# Altium schematic sheet Instruction Register.SchDoc
size A; Author: E. Sims; Organization: Let's Build Rockets Inc.; SheetNumber: 3; SheetTotal: 3
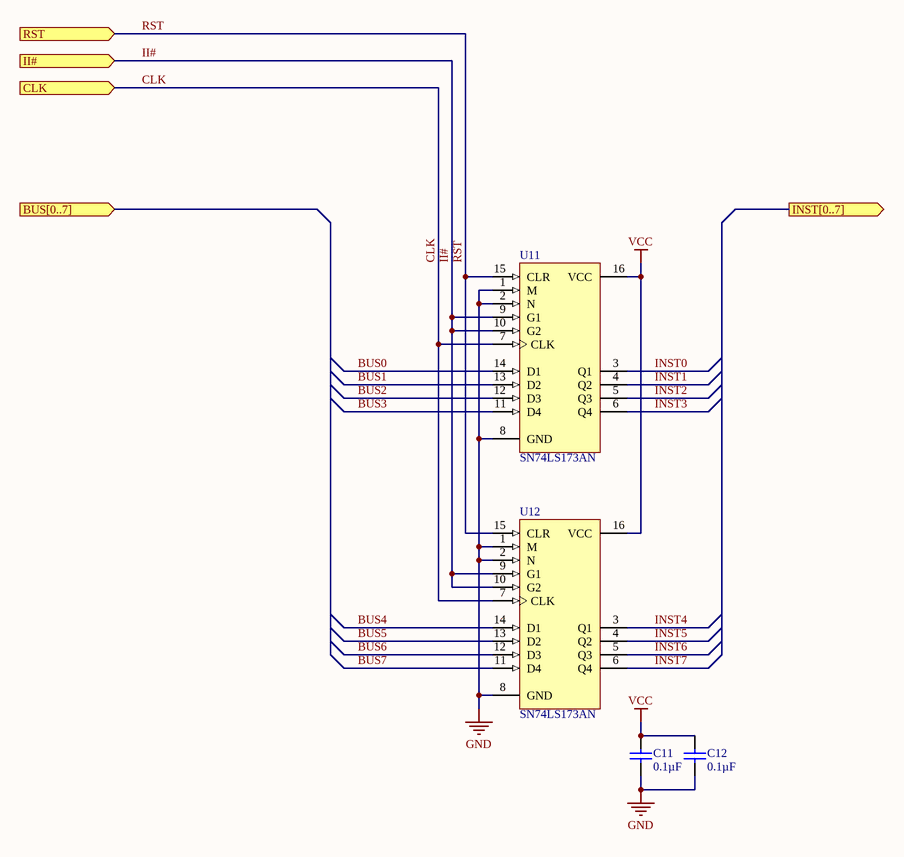
[diagram p0: Instruction Register.SchDoc]

## Parts
C11  Capacitance: 0.1µF  [VISH-K104K15X7RF5TL2]  (hidden comment: K104K15X7RF5TL2)
C12  Capacitance: 0.1µF  [VISH-K104K15X7RF5TL2]  (hidden comment: K104K15X7RF5TL2)
U11  SN74LS173AN  [N016D]
U12  SN74LS173AN  [N016D]

## Ports
BUS[0..7] (in), CLK (in), II# (in), INST[0..7] (out), RST (in)

## Nets
GND: C11.2 C12.2 U11.1(M) U11.2(N) U11.8(GND) U12.1(M) U12.2(N) U12.8(GND)
VCC: C11.1 C12.1 U11.16(VCC) U12.16(VCC)
BUS0: U11.14(D1)
BUS1: U11.13(D2)
BUS2: U11.12(D3)
BUS3: U11.11(D4)
BUS4: U12.14(D1)
BUS5: U12.13(D2)
BUS6: U12.12(D3)
BUS7: U12.11(D4)
CLK: U11.7(CLK) U12.7(CLK) ; port CLK
II#: U11.9(G1) U11.10(G2) U12.9(G1) U12.10(G2) ; port II#
INST0: U11.3(Q1)
INST1: U11.4(Q2)
INST2: U11.5(Q3)
INST3: U11.6(Q4)
INST4: U12.3(Q1)
INST5: U12.4(Q2)
INST6: U12.5(Q3)
INST7: U12.6(Q4)
RST: U11.15(CLR) U12.15(CLR) ; port RST

## Notes on the sheet
- Let's Build Rocket's Inc. Modular Paylaod System Based on TMP-010 Rev
  For more information visit https://github.com/LetsBuildRockets/Modular-Payload-System
  This work is licensed under CC BY-NC 4.0. To view a copy of this license, visit https://creativecommons.org/licenses/by-nc/4.0
- Title
- Size:
- Date:
- Assembly Variant:
- B
- Number:
- Time:
- Revision:
- Sheet
- of
- Author:
- File:

## Library data of the parts
C11 C12 = CMP-2000-06508-1: Ceramic Capacitor, 100 nF, +/- 10%, 50 V, -55 to 125 degC, 2-Pin THD, RoHS, Tape and Reel; Manufacturer: Vishay; Other Names: BC1084CT; Catalog Drawings: Mono-KapSide2-15_5.58Mono-KapSide1_15; Temperature Coefficient: X7R; Voltage - Rated: 50V; Online Catalog: Mono-Kap™Series; Size / Dimension: 0.157"Lx0.098"W(4.00mmx2.50mm); Operating Temperature: -55°C~125°C; Family: CeramicCapacitors; Manufacturer URL: http://www.vishay.com/; Standard Package: 1; Thickness (Max): -; Ratings: -; Datasheet Version: 08/2013; Package Description: 2-Pin Through Hole Device, Body 4 x 2.6 mm; Mounting Type: ThroughHole; Features: -; Lead Spacing: 0.098"(2.50mm); Tolerance: ±10%; Category: Capacitors; Mounting Technology: ThroughHole; Lead Style: Straight; Datasheet URL: http://www.vishay.com/docs/45171/kseries.pdf; Applications: GeneralPurpose; Package / Case: Radial; Height - Seated (Max): 0.220"(5.58mm); Package Reference: K104K15X7RF5TL2; Series: Mono-Kap™K; Packaging: CutTape(CT)
U11 U12 = SN74LS173AN: 4-Bit D-Type Register with 3-State Outputs; Published: 8-Jun-2000; LatestRevisionDate: 04-Mar-2005; LatestRevisionNote: Stylized 3D Model Added.; DatasheetVersion: Mar-1988; PackageVersion: Oct-1995; PackageReference: N016D; Publisher: Altium Limited; PackageDescription: DIP; 16 Leads; Row Spacing 7.62 mm; Pitch 2.54 mm; Code_JEDEC: MS-001-BB; ComponentLink1Description: Manufacturer Link; ComponentLink1URL: http://www.ti.com/; ComponentLink2Description: Datasheet; ComponentLink2URL: http://www-s.ti.com/sc/ds/sn74ls173a.pdf